# Altium project Lab 2.PrjPcb
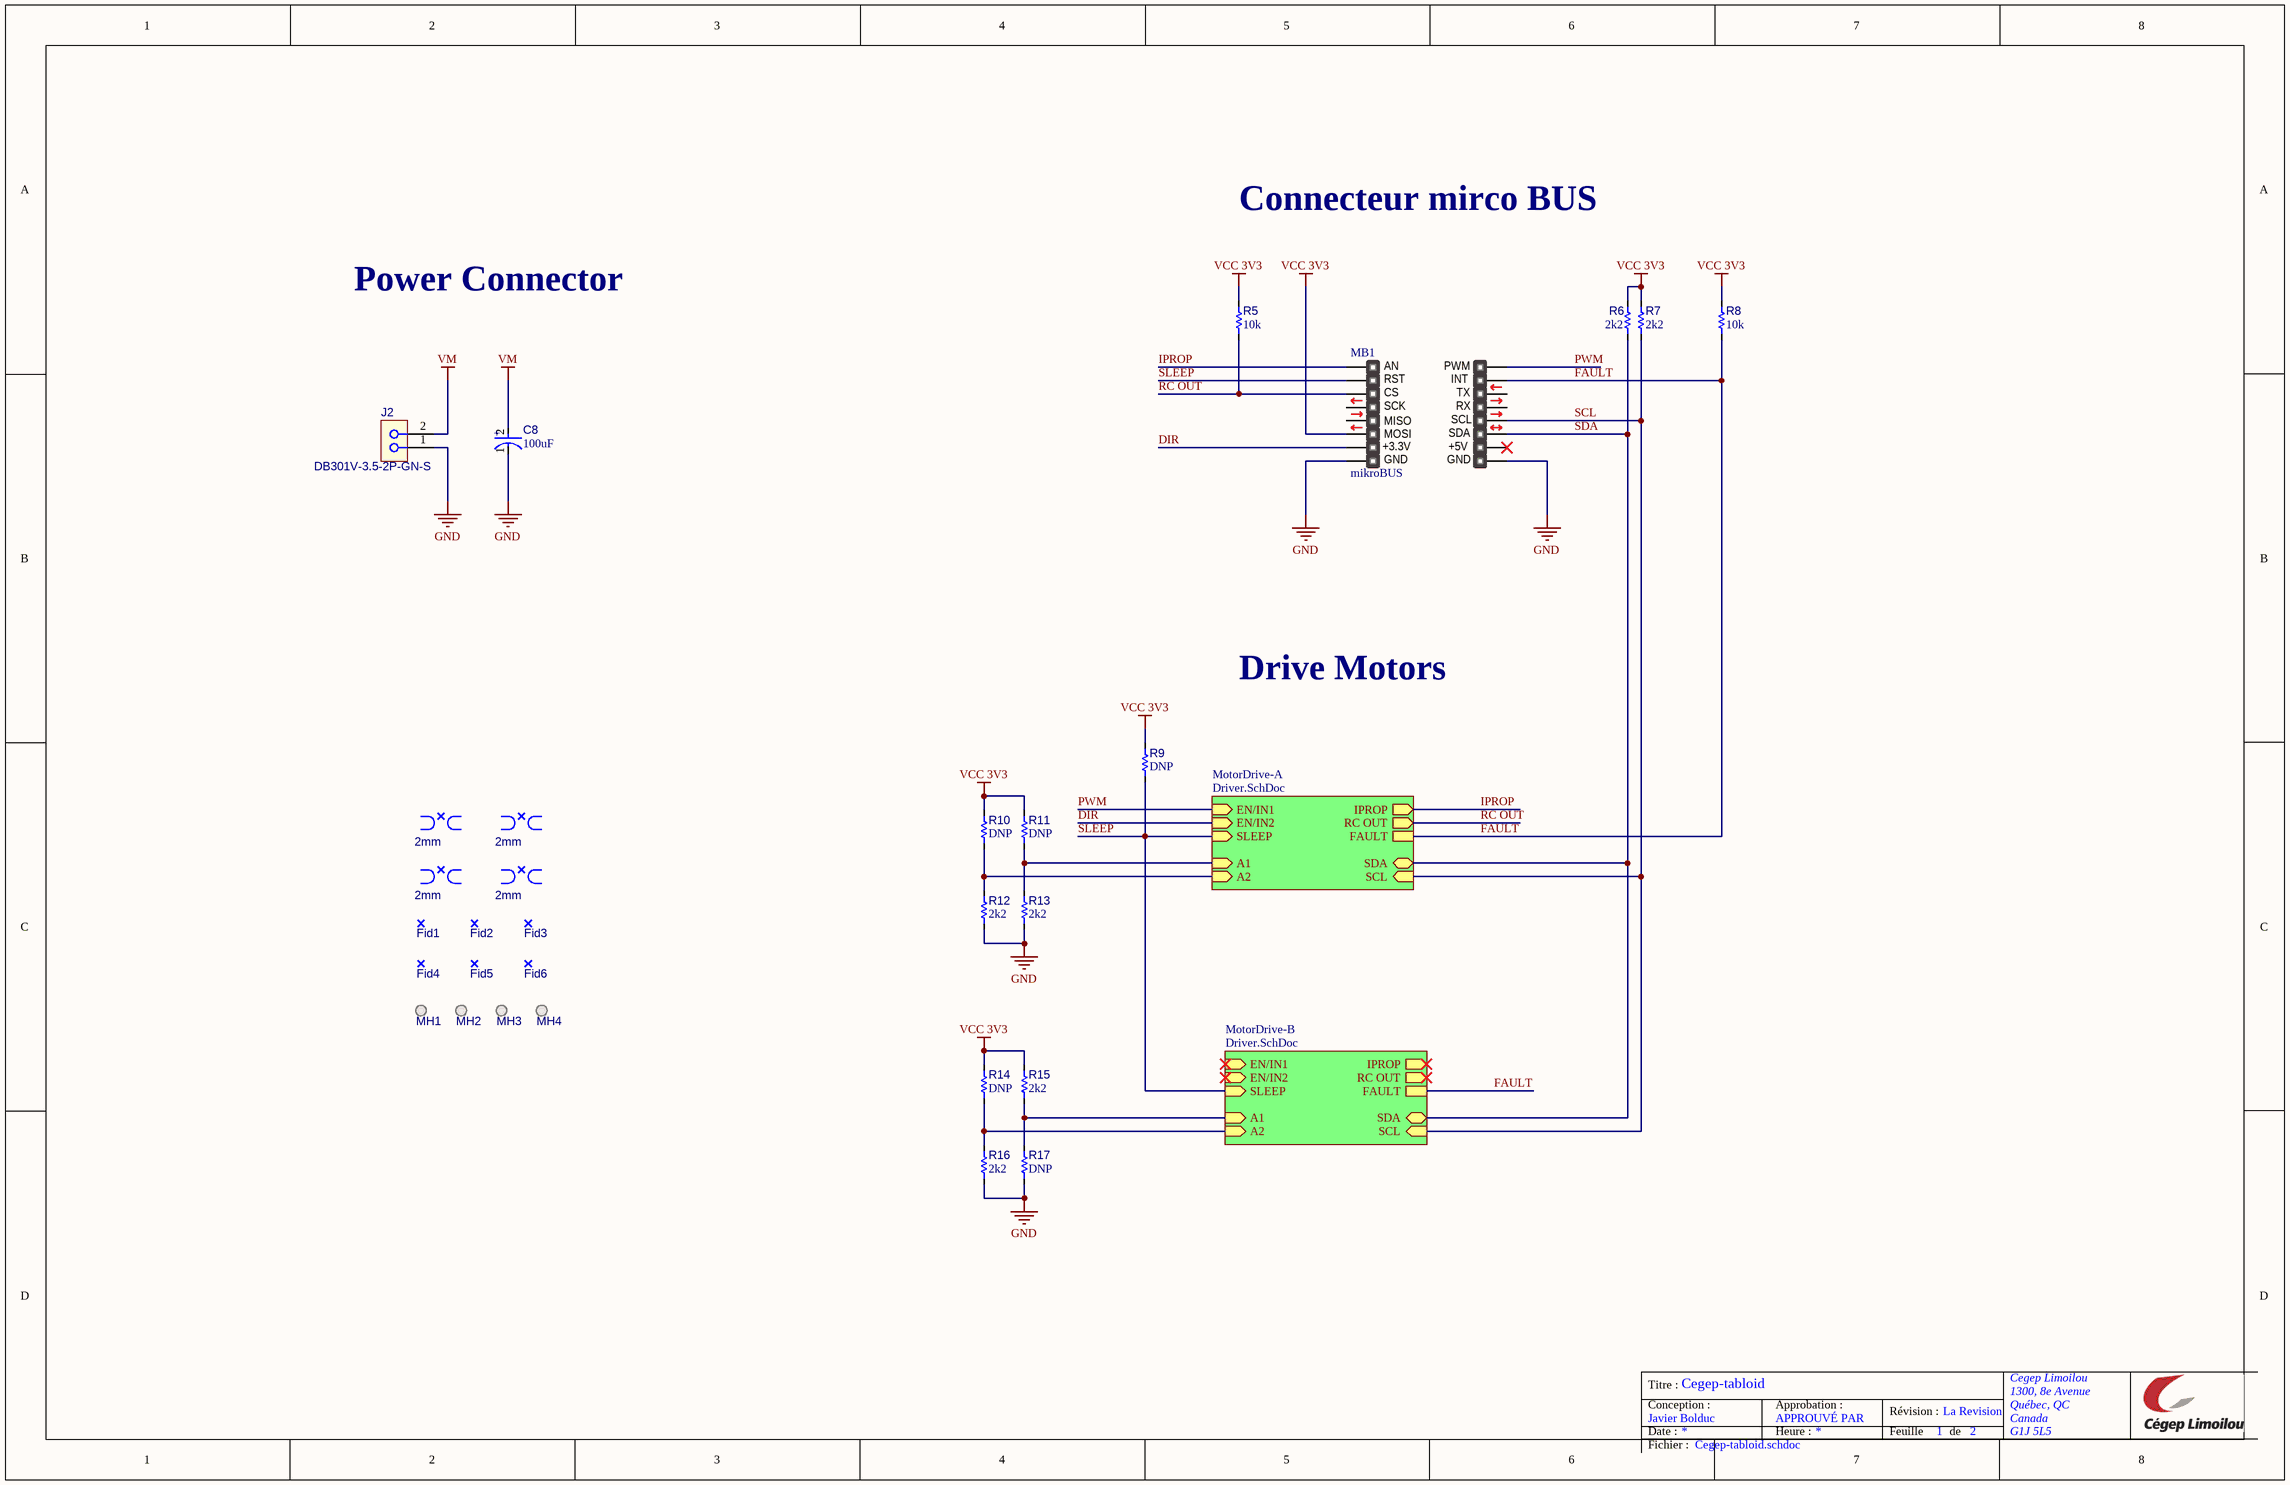
[diagram p0: Cegep-tabloid.schdoc]
NomDeLetudiant: Le nom de l'étudiant; NomDeProjet: Le nom de mon Projet; Revision: La Revision
2 sheets, 56 parts. Net scope: hierarchical (ports join the sheet entries above them; power ports are global).
Board file: Pcb1.PcbDoc
Sheets:
  Cegep-tabloid.schdoc
    MotorDrive-A = Driver.SchDoc
    MotorDrive-B = Driver.SchDoc

## Sheet Cegep-tabloid.schdoc: Cegep-tabloid
size Tabloid; ApprovedBy: APPROUVÉ PAR; Author: Javier Bolduc; Organization: Cegep Limoilou; Address1: 1300, 8e Avenue; Address2: Québec, QC; Address3: Canada; Address4: G1J 5L5; SheetNumber: 1; SheetTotal: 2

### Parts
BRK1  value 2mm  [BK_CRACK1B_M]  (hidden comment: DNP)  (no BOM)
BRK2  value 2mm  [BK_CRACK1B_M]  (hidden comment: DNP)  (no BOM)
BRK3  value 2mm  [BK_CRACK1B_M]  (hidden comment: DNP)  (no BOM)
BRK4  value 2mm  [BK_CRACK1B_M]  (hidden comment: DNP)  (no BOM)
C8  value 100uF  [C_EL_D10MM-L11MM]  (hidden comment: CAP EL 100uF 63V 10MM)
Fid1  DNP  [FD_Fiducial]  (value not drawn)  (no BOM)
Fid2  DNP  [FD_Fiducial]  (value not drawn)  (no BOM)
Fid3  DNP  [FD_Fiducial]  (value not drawn)  (no BOM)
Fid4  DNP  [FD_Fiducial]  (value not drawn)  (no BOM)
Fid5  DNP  [FD_Fiducial]  (value not drawn)  (no BOM)
Fid6  DNP  [FD_Fiducial]  (value not drawn)  (no BOM)
J2  DB301V-3.5-2P-GN-S  [CONN_TERM_BLOCK_2POS_3mm5]
MB1  mikroBUS  [mikroBUS - Midi]
MH1  DNP  [MP_M-Hole_M2-NonPlated]  (value not drawn)  (no BOM)
MH2  DNP  [MP_M-Hole_M2-NonPlated]  (value not drawn)  (no BOM)
MH3  DNP  [MP_M-Hole_M2-NonPlated]  (value not drawn)  (no BOM)
MH4  DNP  [MP_M-Hole_M2-NonPlated]  (value not drawn)  (no BOM)
R5  value 10k  [R_1005[0402]]  (hidden comment: Res 10k 1% 0402)
R6  value 2k2  [R_1005[0402]]  (hidden comment: Res 2k2 1% 0402)
R7  value 2k2  [R_1005[0402]]  (hidden comment: Res 2k2 1% 0402)
R8  value 10k  [R_1005[0402]]  (hidden comment: Res 10k 1% 0402)
R9  value DNP  [R_1005[0402]]  (hidden comment: Res 2k2 1% 0402)  (no BOM)
R10  value DNP  [R_1005[0402]]  (hidden comment: Res 2k2 1% 0402)  (no BOM)
R11  value DNP  [R_1005[0402]]  (hidden comment: Res 2k2 1% 0402)  (no BOM)
R12  value 2k2  [R_1005[0402]]  (hidden comment: Res 2k2 1% 0402)
R13  value 2k2  [R_1005[0402]]  (hidden comment: Res 2k2 1% 0402)
R14  value DNP  [R_1005[0402]]  (hidden comment: Res 2k2 1% 0402)  (no BOM)
R15  value 2k2  [R_1005[0402]]  (hidden comment: Res 2k2 1% 0402)
R16  value 2k2  [R_1005[0402]]  (hidden comment: Res 2k2 1% 0402)
R17  value DNP  [R_1005[0402]]  (hidden comment: Res 2k2 1% 0402)  (no BOM)

### Sub-sheets
MotorDrive-A = Driver.SchDoc: RC OUT (out), A2 (in), A1 (in), SDA (bidir), SCL (in), FAULT, EN/IN1 (in), EN/IN2 (in), SLEEP (in), IPROP (out)
MotorDrive-B = Driver.SchDoc: RC OUT (out), A2 (in), A1 (in), SDA (bidir), SCL (in), FAULT, EN/IN1 (in), EN/IN2 (in), SLEEP (in), IPROP (out)

### Nets
GND: C8.1(C) J2.1 MB1.8(GND) MB1.9(GND) R12.2 R13.2 R16.2 R17.2
VCC 3V3: MB1.6(MOSI) R5.1 R6.1 R7.1 R8.1 R9.1 R10.1 R11.1 R14.1 R15.1
VM: C8.2(A) J2.2
DIR: MB1.7(3.3V) ; sheet MotorDrive-A/EN/IN2
FAULT: MB1.15(INT) R8.2 ; sheet MotorDrive-A/FAULT, sheet MotorDrive-B/FAULT
IPROP: MB1.1(AN) ; sheet MotorDrive-A/IPROP
PWM: MB1.16(PWM) ; sheet MotorDrive-A/EN/IN1
RC OUT: MB1.3(CS) R5.2 ; sheet MotorDrive-A/RC OUT
SCL: MB1.12(SCL) R7.2 ; sheet MotorDrive-A/SCL, sheet MotorDrive-B/SCL
SDA: MB1.11(SDA) R6.2 ; sheet MotorDrive-A/SDA, sheet MotorDrive-B/SDA
SLEEP: MB1.2(RST) R9.2 ; sheet MotorDrive-A/SLEEP, sheet MotorDrive-B/SLEEP
NetR10_2: R10.2 R12.1 ; sheet MotorDrive-A/A2
NetR11_2: R11.2 R13.1 ; sheet MotorDrive-A/A1
NetR14_2: R14.2 R16.1 ; sheet MotorDrive-B/A2
NetR15_2: R15.2 R17.1 ; sheet MotorDrive-B/A1

Not connected (* = marked no-connect by the designer): BRK1 1 2 3 4 5; BRK2 1 2 3 4 5; BRK3 1 2 3 4 5; BRK4 1 2 3 4 5; Fid1 1 2 3 4 5; Fid2 1 2 3 4 5; Fid3 1 2 3 4 5; Fid4 1 2 3 4 5; Fid5 1 2 3 4 5; Fid6 1 2 3 4 5; MB1 4(SCK) 5(MISO) 10(5V)* 13(TX) 14(RX)

### Notes on the sheet
- Connecteur mirco BUS
- Power Connector
- Drive Motors
- Titre :
- Conception :
- Date :
- Approbation :
- Heure :
- Révision :
- Feuille
- de
- Fichier :
- (in symbol CAP021) +
- (in symbol mikroBUS compatible add-on board) +3.3V; +5V

### Library data of the parts
BRK1-BRK4 = BK_BREAKOUT_2MM: Mouse Bites; Manufacturer_PN: DNP; RoHS: N/A; Technology: N/A
C8 = CAP021: Capacitor type EL; Manufacturer 1: HRK; Manufacturer Part Number 1: GVT1J107M1010CNVC; LibRef: CAP021; Tolerance: 20%; Rated Voltage: 63V; Dielectric: EL; Mounting Technology: SMT; Supplier 1: LCSC; Supplier Part Number 1: C2983410
Fid1-Fid6 = Fiducial: Fiducial for Pick&Place; Manufacturer_PN: DNP; Value: Fiducial for Pick&Place
J2 = CONN-3MM5-2POS-TERM-BLOCK: CONN TERM BLOCK 2POS 3.5mm pitch; Manufacturer 1: Dorabo; Supplier 1: LCSC; Supplier Part Number 1: C695629; Manufacturer Part Number 1: DB301V-3.5-2P-GN-S; Mounting Technology: TH
MB1 = mikroBUS compatible add-on board
MH1-MH4 = MH-2MM_NP: Mounting Hole 2mm non plated; Manufacturer Part Number 1: DNP; Value: Mounting Hole 2mm non plated; Supplier Part Number 1: N/A
R5 R8 = RES003: Resistor type 1; Manufacturer 1: Yageo; Manufacturer Part Number 1: RC0402FR-0710KL; LibRef: RES003; Puissance: 1/16W; Max Working Voltage: 50V; Tolerance: 1%; Mounting Technology: SMT; Supplier 1: LCSC; Supplier Part Number 1: C60490
R6 R7 R9-R17 = RES008: Resistor type 1; Manufacturer 1: Yageo; Manufacturer Part Number 1: RC0402FR-072K2L; LibRef: RES008; Code CEGEP: RES2.2KSM; Puissance: 1/16W; Max Working Voltage: 50V; Tolerance: 1%; Mounting Technology: SMT; Supplier 1: LCSC; Supplier Part Number 1: C114762; Supplier 2: Digi-Key; Supplier Part Number 2: 311-2.20KLRCT-ND

## Sheet Driver.SchDoc: MotorDriver
size Letter; ApprovedBy: APPROUVÉ PAR; Author: Javier Bolduc; Organization: Cegep Limoilou; Address1: 1300, 8e Avenue; Address2: Québec, QC; Address3: Canada; Address4: G1J 5L5; SheetNumber: 2; SheetTotal: 2
Used 2 times, as channels MotorDrive-A, MotorDrive-B. Parts and nets are listed once, with the designators drawn on the sheet.
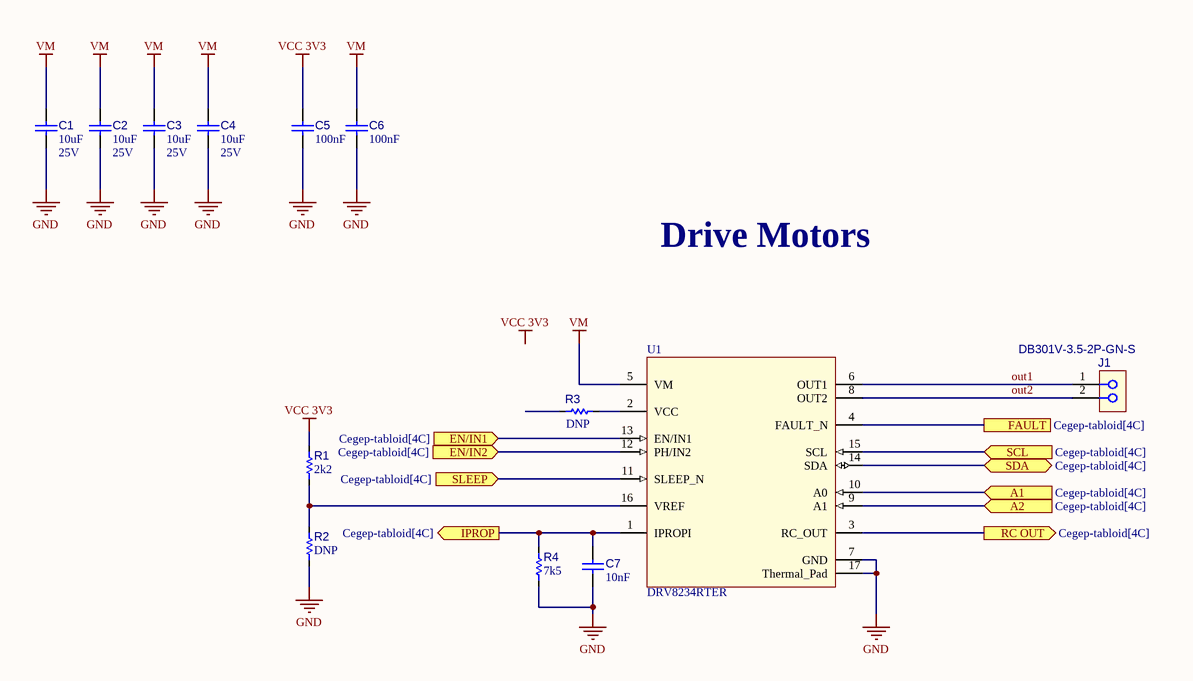
[diagram p1: Driver.SchDoc]

### Parts
C1  value 10uF  Rated Voltage: 25V  [C_2012[0805]]  (hidden comment: CAP CER 10uF 25V X5R 0805)
C2  value 10uF  Rated Voltage: 25V  [C_2012[0805]]  (hidden comment: CAP CER 10uF 25V X5R 0805)
C3  value 10uF  Rated Voltage: 25V  [C_2012[0805]]  (hidden comment: CAP CER 10uF 25V X5R 0805)
C4  value 10uF  Rated Voltage: 25V  [C_2012[0805]]  (hidden comment: CAP CER 10uF 25V X5R 0805)
C5  value 100nF  [C_1005[0402]]  (hidden comment: CAP CER 100nF 50V 0402)
C6  value 100nF  [C_1005[0402]]  (hidden comment: CAP CER 100nF 50V 0402)
C7  value 10nF  [C_1005[0402]]  (hidden comment: CAP CER 10nF 50V X7R 0402)
J1  DB301V-3.5-2P-GN-S  [CONN_TERM_BLOCK_2POS_3mm5]
R1  value 2k2  [R_1005[0402]]  (hidden comment: Res 2k2 1% 0402)
R2  value DNP  [R_1005[0402]]  (hidden comment: Res 2k2 1% 0402)  (no BOM)
R3  value DNP  [R_1005[0402]]  (hidden comment: Res 2k2 1% 0402)  (no BOM)
R4  value 7k5  [R_1005[0402]]  (hidden comment: Res 7k5 1% 0402)
U1  DRV8234RTER  [U_WQFN50P300X300-16]

### Ports
A1 (in, see Cegep-tabloid[4C]), A2 (in, see Cegep-tabloid[4C]), EN/IN1 (in, see Cegep-tabloid[4C]), EN/IN2 (in, see Cegep-tabloid[4C]), FAULT (see Cegep-tabloid[4C]), IPROP (out, see Cegep-tabloid[4C]), RC OUT (out, see Cegep-tabloid[4C]), SCL (in, see Cegep-tabloid[4C]), SDA (bidir, see Cegep-tabloid[4C]), SLEEP (in, see Cegep-tabloid[4C])

### Nets
GND: C1.2 C2.2 C3.2 C4.2 C5.2 C6.2 C7.1 R2.2 R4.2 U1.7(GND) U1.17(Thermal_Pad)
VCC 3V3: C5.1 R1.1
VM: C1.1 C2.1 C3.1 C4.1 C6.1 U1.5(VM)
A1: U1.10(A0) ; port A1
A2: U1.9(A1) ; port A2
EN/IN1: U1.13(EN/IN1) ; port EN/IN1
EN/IN2: U1.12(PH/IN2) ; port EN/IN2
FAULT: U1.4(FAULT_N) ; port FAULT
IPROP: C7.2 R4.1 U1.1(IPROPI) ; port IPROP
out1: J1.1 U1.6(OUT1)
out2: J1.2 U1.8(OUT2)
RC OUT: U1.3(RC_OUT) ; port RC OUT
SCL: U1.15(SCL) ; port SCL
SDA: U1.14(SDA) ; port SDA
SLEEP: U1.11(SLEEP_N) ; port SLEEP
NetR1_2: R1.2 R2.1 U1.16(VREF)
NetR3_1: R3.1 U1.2(VCC)

Not connected (* = marked no-connect by the designer): R3 2

### Channels
MotorDrive-A: designators end in _A; ports A1=NetR11_2 A2=NetR10_2 EN/IN1=PWM EN/IN2=DIR FAULT=FAULT IPROP=IPROP RC OUT=RC OUT SCL=SCL SDA=SDA SLEEP=SLEEP
MotorDrive-B: designators end in _B; ports A1=NetR15_2 A2=NetR14_2 EN/IN1=NetU1_B_13 EN/IN2=NetU1_B_12 FAULT=FAULT IPROP=NetC7_B_2 RC OUT=NetU1_B_3 SCL=SCL SDA=SDA SLEEP=SLEEP

### Notes on the sheet
- Drive Motors
- Labels drawn without touching a wire or pin: VCC 3V3
- Titre :
- Conception :
- Date :
- Approbation :
- Heure :
- Révision :
- Feuille
- de
- Fichier :

### Library data of the parts
C1-C4 = CAP020: Capacitor type 1; Manufacturer 1: Samsung; Manufacturer Part Number 1: CL21A106KAYNNNE; Tolerance: 10%; LibRef: CAP020; Dielectric: X5R; Mounting Technology: SMT; Supplier 1: LCSC; Supplier Part Number 1: C86038
C5 C6 = CAP001: Capacitor type 1; Manufacturer 1: Taiyo Yuden; Manufacturer Part Number 1: UMK105B7104KV-FR; Tolerance: 10%; Dielectric: X7R; Code CEGEP: KCOND01SM; LibRef: CAP001; Rated Voltage: 50V; Mounting Technology: SMT; Supplier 1: LCSC; Supplier Part Number 1: C2167491
C7 = CAP017: Capacitor type 1; Manufacturer 1: Yageo; Manufacturer Part Number 1: CC0402KRX7R9BB103; Tolerance: 10%; LibRef: CAP017; Rated Voltage: 50V; Dielectric: X7R; Mounting Technology: SMT; Supplier 1: LCSC; Supplier Part Number 1: C60133
J1 = CONN-3MM5-2POS-TERM-BLOCK: as J2 on sheet Cegep-tabloid; Supplier 1: LCSC; Supplier Part Number 1: C695629; Manufacturer Part Number 1: DB301V-3.5-2P-GN-S; Mounting Technology: TH
R1-R3 = RES008: Resistor type 1; Manufacturer 1: Yageo; Manufacturer Part Number 1: RC0402FR-072K2L; Puissance: 1/16W; Max Working Voltage: 50V; Code CEGEP: RES2.2KSM; LibRef: RES008; Tolerance: 1%; Mounting Technology: SMT; Supplier 1: LCSC; Supplier Part Number 1: C114762; Supplier 2: Digi-Key; Supplier Part Number 2: 311-2.20KLRCT-ND
R4 = RES027: Resistor type 1; Manufacturer 1: Yageo; Manufacturer Part Number 1: RC0402FR-077k5L; LibRef: RES027; Puissance: 1/16W; Max Working Voltage: 50V; Tolerance: 1%; Mounting Technology: SMT; Supplier 1: LCSC; Supplier Part Number 1: C137934
U1 = U_DRV8234: Brushed DC H-bridge Motor Driver with Ripple Counting, Stall Detection, and Speed Regulation 38V 2A 16-WQFN; Manufacturer 1: Texas Instruments; Mounting Technology: SMT; Manufacturer Part Number 1: DRV8234RTER; Supplier 1: LCSC

## Nets that join several sheets
GND: Cegep-tabloid (8 pins), MotorDrive-A (11 pins), MotorDrive-B (11 pins)
VCC 3V3: Cegep-tabloid (10 pins), MotorDrive-A (C5_A.1 R1_A.1), MotorDrive-B (C5_B.1 R1_B.1)
VM: Cegep-tabloid (C8.2 J2.2), MotorDrive-A (6 pins), MotorDrive-B (6 pins)
DIR: Cegep-tabloid (MB1.7), MotorDrive-A (U1_A.12)
FAULT: Cegep-tabloid (MB1.15 R8.2), MotorDrive-A (U1_A.4), MotorDrive-B (U1_B.4)
IPROP: Cegep-tabloid (MB1.1), MotorDrive-A (C7_A.2 R4_A.1 U1_A.1)
NetR10_2: Cegep-tabloid (R10.2 R12.1), MotorDrive-A (U1_A.9)
NetR11_2: Cegep-tabloid (R11.2 R13.1), MotorDrive-A (U1_A.10)
NetR14_2: Cegep-tabloid (R14.2 R16.1), MotorDrive-B (U1_B.9)
NetR15_2: Cegep-tabloid (R15.2 R17.1), MotorDrive-B (U1_B.10)
PWM: Cegep-tabloid (MB1.16), MotorDrive-A (U1_A.13)
RC OUT: Cegep-tabloid (MB1.3 R5.2), MotorDrive-A (U1_A.3)
SCL: Cegep-tabloid (MB1.12 R7.2), MotorDrive-A (U1_A.15), MotorDrive-B (U1_B.15)
SDA: Cegep-tabloid (MB1.11 R6.2), MotorDrive-A (U1_A.14), MotorDrive-B (U1_B.14)
SLEEP: Cegep-tabloid (MB1.2 R9.2), MotorDrive-A (U1_A.11), MotorDrive-B (U1_B.11)